# Altium project WIFIModule_M_V1.0.PrjPCB
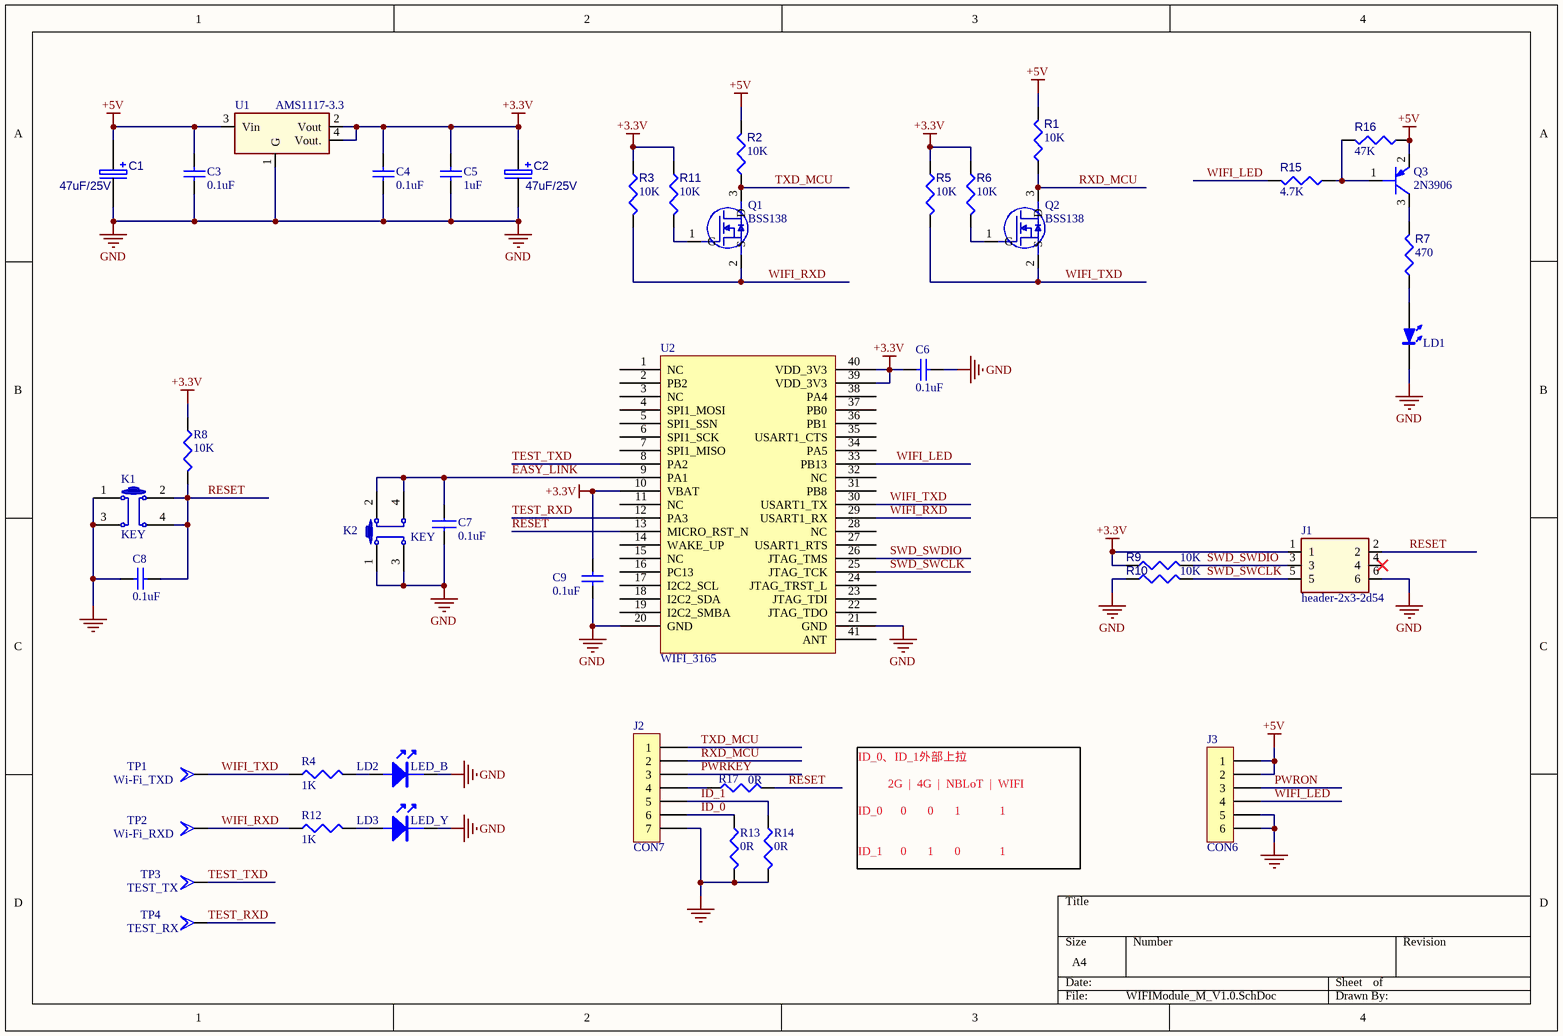
[diagram p0: WIFIModule_M_V1.0.SchDoc]
1 sheet, 43 parts. Net scope: global (net labels, ports and power ports of the same name join across sheets).
Board file: WIFIModule_M_V1.0.1.PcbDoc

## Sheet WIFIModule_M_V1.0.SchDoc
size A4

### Parts
C1  47uF/25V  [C_TAN_B]
C2  47uF/25V  [C_TAN_B]
C3  0.1uF  [0603_C]
C4  0.1uF  [0603_C]
C5  1uF  [0603_C]
C6  0.1uF  [0603_C]
C7  0.1uF  [0603_C]
C8  0.1uF  [0603_C]
C9  0.1uF  [0603_C]
J1  header-2x3-2d54  [HT8550_FLASH_LOADER]
J2  CON7  [SIP7]
J3  CON6  [SIP6]
K1  KEY  [KEY_SMD5465]
K2  KEY  [KEY_SMD5465]
LD1  WHITE  [LED_0603]  (value not drawn)
LD2  LED_B  [LED_0603]
LD3  LED_Y  [LED_0603]
Q1  BSS138  [SOT23]
Q2  BSS138  [SOT23]
Q3  2N3906  [SOT23]
R1  10K  [0603_R]
R2  10K  [0603_R]
R3  10K  [0603_R]
R4  1K  [0603_R]
R5  10K  [0603_R]
R6  10K  [0603_R]
R7  470  [0603_R]
R8  10K  [0603_R]
R9  10K  [0603_R]
R10  10K  [0603_R]
R11  10K  [0603_R]
R12  1K  [0603_R]
R13  0R  [0603_R]
R14  0R  [0603_R]
R15  4.7K  [0603_R]
R16  47K  [0603_R]
R17  0R  [0603_R]
TP1  Wi-Fi_TXD  [TP_60_30]
TP2  Wi-Fi_RXD  [TP_60_30]
TP3  TEST_TX  [TP_60_30]
TP4  TEST_RX  [TP_60_30]
U1  AMS1117-3.3  [SOT223]
U2  WIFI_3165  [EMW3165-P]

### Nets
+3.3V: C2.1(+) C4.1 C5.1 C6.2 C9.2 J1.1 R3.1 R5.1 R6.1 R8.2 R9.1 R11.1 U1.2(Vout) U1.4(Vout.) U2.10(VBAT) U2.39(VDD_3V3) U2.40(VDD_3V3)
+5V: C1.1(+) C3.1 J3.1 J3.2 Q3.2(EMITTER) R1.2 R2.2 R16.1 U1.3(Vin)
GND: C1.2(-) C2.2(-) C3.2 C4.2 C5.2 C6.1 C7.2 C8.1 C9.1 J1.6 J2.7 J3.5 J3.6 K1.1 K1.3 K2.1 K2.3 LD1.K LD2.K LD3.K R10.1 R13.2 R14.2 U1.1(G) U2.20(GND) U2.21(GND)
EASY_LINK: C7.1 K2.2 K2.4 U2.9(PA1)
ID_0: J2.6 R13.1
ID_1: J2.5 R14.1
PWRKEY: J2.3
PWRON: J3.3
RESET: C8.2 J1.2 K1.2 K1.4 R8.1 R17.2 U2.13(MICRO_RST_N)
RXD_MCU: J2.2 Q2.3(D) R1.1
SWD_SWCLK: J1.5 R10.2 U2.25(JTAG_TCK)
SWD_SWDIO: J1.3 R9.2 U2.26(JTAG_TMS)
TEST_RXD: TP4.1(TP) U2.12(PA3)
TEST_TXD: TP3.1(TP) U2.8(PA2)
TXD_MCU: J2.1 Q1.3(D) R2.1
WIFI_LED: J3.4 R15.2 U2.33(PB13)
WIFI_RXD: Q1.2(S) R3.2 R12.1 TP2.1(TP) U2.29(USART1_RX)
WIFI_TXD: Q2.2(S) R4.1 R5.2 TP1.1(TP) U2.30(USART1_TX)
NetJ2_4: J2.4 R17.1
NetLD1_A: LD1.A R7.1
NetLD2_A: LD2.A R4.2
NetLD3_A: LD3.A R12.2
NetQ1_1: Q1.1(G) R11.2
NetQ2_1: Q2.1(G) R6.2
NetQ3_1: Q3.1(BASE) R15.1 R16.2
NetQ3_3: Q3.3(COLLECTOR) R7.2

Not connected (* = marked no-connect by the designer): J1 4*; U2 1(NC) 2(PB2) 3(NC) 4(SPI1_MOSI) 5(SPI1_SSN) 6(SPI1_SCK) 7(SPI1_MISO) 11(NC) 14(WAKE_UP) 15(NC) 16(PC13) 17(I2C2_SCL) 18(I2C2_SDA) 19(I2C2_SMBA) 22(JTAG_TDO) 23(JTAG_TDI) 24(JTAG_TRST_L) 27(USART1_RTS) 28(NC) 31(PB8) 32(NC) 34(PA5) 35(USART1_CTS) 36(PB1) 37(PB0) 38(PA4) 41(ANT)

### Notes on the sheet
- ID_0、ID_1外部上拉
  2G  |  4G  |  NBLoT  |  WIFI
  ID_0      0       0       1             1
  ID_1      0       1       0             1

### Library data of the parts
C1 C2 = ECAP: E-CAP
C3-C6 C9 = Cap Semi_1: Capacitor; Published: 8-Jun-2000; LatestRevisionDate: 29-May-2009; LatestRevisionNote: IPC-7351 Footprint Added.; PackageReference: C1206; Publisher: Altium Limited; PackageDescription: Chip Capacitor
C7 = CAP NP
C8 = Cap: Capacitor; Published: 8-Jun-2000; LatestRevisionDate: 17-Jul-2002; LatestRevisionNote: Re-released for DXP Platform.; PackageReference: RAD-0.3; Publisher: Altium Limited; Value: 0.1UF
LD1-LD3 = LED
Q1 Q2 = N-Channel Enhancement MOSFET
Q3 = PNP
R1-R3 R5 R6 R11 = Res3_3: Resistor; Published: 8-Jun-2000; LatestRevisionDate: 29-May-2009; LatestRevisionNote: IPC-7351 Footprint Added.; PackageReference: J1-0603; Publisher: Altium Limited; PackageDescription: Chip Resistor
R4 R12 = R
R7-R10 R15 R16 = Res3: Resistor; Published: 8-Jun-2000; PackageReference: J1-0603; Publisher: Altium Limited
  R7 R9 R10 R15 R16: LatestRevisionDate: 29-May-2009; LatestRevisionNote: IPC-7351 Footprint Added.; PackageDescription: Chip Resistor
  R8: LatestRevisionDate: 04-Mar-2005; LatestRevisionNote: PCB Footprint replaced.; Value: 10K
R13 R14 R17 = RES1
TP1-TP4 = T POINT A